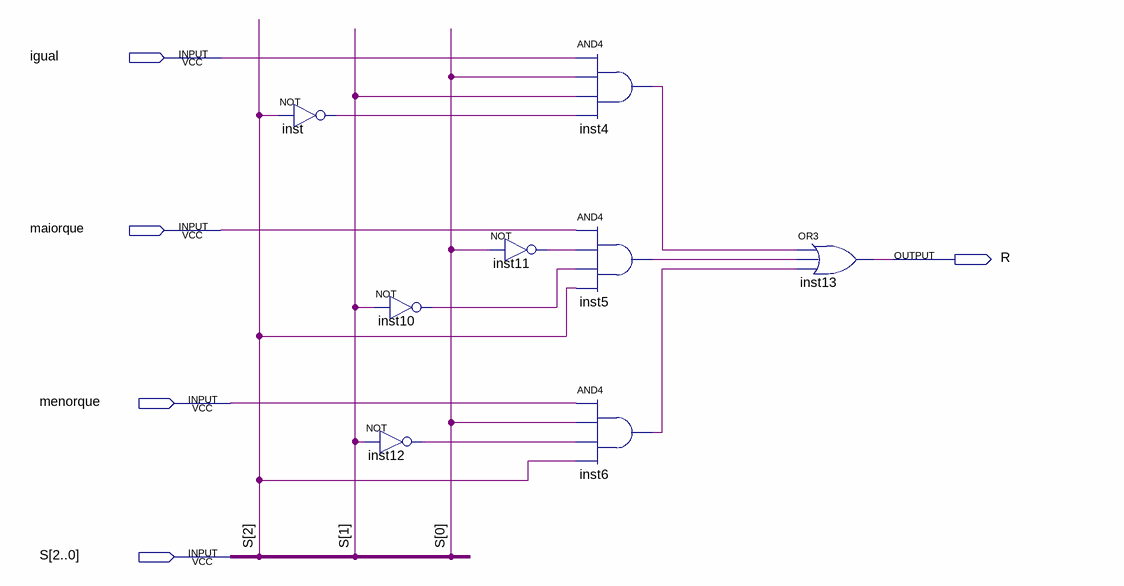
[diagram p0: schematic sheet]
// Quartus schematic mux3.bdf as structural Verilog: 8 symbols, 5 pins
module mux3 (
  input  igual,
  input  maiorque,
  input  menorque,
  input  [2:0] S,
  output R
);

  wire inst4_out, inst5_out, inst6_out, inst10_out, inst11_out, inst12_out, inst_out;

  not inst (inst_out, S[2]);
  not inst10 (inst10_out, S[1]);
  not inst12 (inst12_out, S[1]);
  not inst11 (inst11_out, S[0]);
  and inst4 (inst4_out, igual, S[0], S[1], inst_out);
  and inst5 (inst5_out, maiorque, inst11_out, inst10_out, S[2]);
  and inst6 (inst6_out, menorque, S[0], inst12_out, S[2]);
  or inst13 (R, inst4_out, inst5_out, inst6_out);
endmodule
